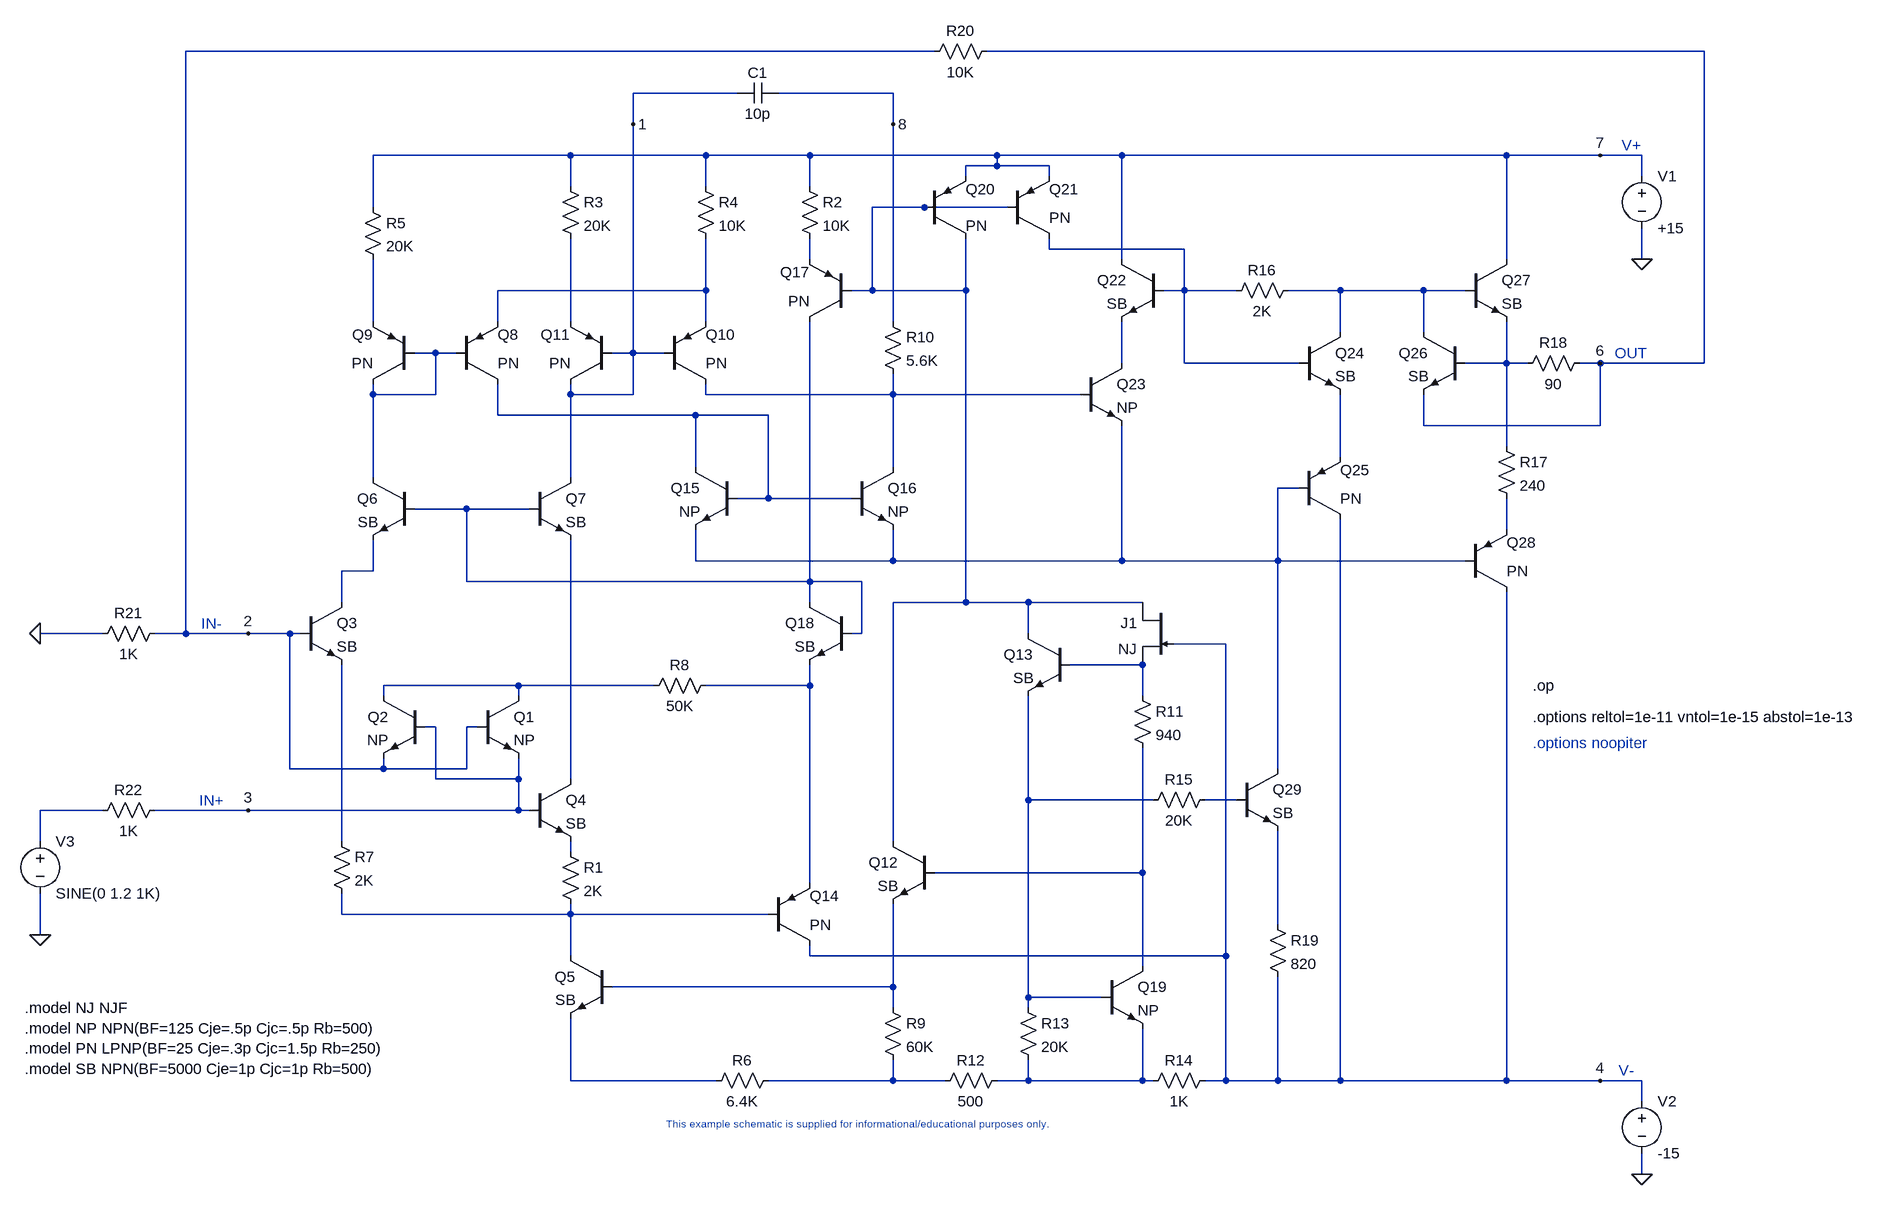
[diagram p0: schematic debugDotOp.asc]
debugDotOp.asc, the LTspice schematic file:
Version 4
SHEET 1 4272 2276
WIRE 2448 528 1296 528
WIRE 3632 528 2528 528
WIRE 2144 592 1984 592
WIRE 2384 592 2208 592
WIRE 1984 640 1984 592
WIRE 2384 640 2384 592
WIRE 1888 688 1584 688
WIRE 2096 688 1888 688
WIRE 2256 688 2096 688
WIRE 2544 688 2256 688
WIRE 2736 688 2544 688
WIRE 3328 688 2736 688
WIRE 3472 688 3328 688
WIRE 3536 688 3472 688
WIRE 2544 704 2544 688
WIRE 2544 704 2496 704
WIRE 2624 704 2544 704
WIRE 2496 720 2496 704
WIRE 2624 720 2624 704
WIRE 3536 720 3536 688
WIRE 1888 736 1888 688
WIRE 2096 736 2096 688
WIRE 2256 736 2256 688
WIRE 1584 768 1584 688
WIRE 2432 768 2352 768
WIRE 2560 768 2432 768
WIRE 2624 832 2624 816
WIRE 2832 832 2624 832
WIRE 2256 848 2256 816
WIRE 2736 848 2736 688
WIRE 3328 848 3328 688
WIRE 3536 848 3536 800
WIRE 2096 896 2096 816
WIRE 2096 896 1776 896
WIRE 2352 896 2352 768
WIRE 2352 896 2320 896
WIRE 2496 896 2496 816
WIRE 2496 896 2352 896
WIRE 2832 896 2832 832
WIRE 2832 896 2800 896
WIRE 2912 896 2832 896
WIRE 3072 896 2992 896
WIRE 3200 896 3072 896
WIRE 3264 896 3200 896
WIRE 1584 944 1584 848
WIRE 1776 944 1776 896
WIRE 1888 944 1888 816
WIRE 2096 944 2096 896
WIRE 2384 944 2384 640
WIRE 3072 960 3072 896
WIRE 3200 960 3200 896
WIRE 1680 992 1648 992
WIRE 1712 992 1680 992
WIRE 1984 992 1984 640
WIRE 1984 992 1952 992
WIRE 2032 992 1984 992
WIRE 2736 1008 2736 944
WIRE 2832 1008 2832 896
WIRE 3008 1008 2832 1008
WIRE 3328 1008 3328 944
WIRE 3328 1008 3264 1008
WIRE 3360 1008 3328 1008
WIRE 3472 1008 3440 1008
WIRE 3632 1008 3632 528
WIRE 3632 1008 3472 1008
WIRE 1584 1056 1584 1040
WIRE 1680 1056 1680 992
WIRE 1680 1056 1584 1056
WIRE 1888 1056 1888 1040
WIRE 1984 1056 1984 992
WIRE 1984 1056 1888 1056
WIRE 2096 1056 2096 1040
WIRE 2384 1056 2384 1024
WIRE 2384 1056 2096 1056
WIRE 2672 1056 2384 1056
WIRE 1776 1088 1776 1040
WIRE 2080 1088 1776 1088
WIRE 2192 1088 2080 1088
WIRE 3200 1104 3200 1056
WIRE 3472 1104 3472 1008
WIRE 3472 1104 3200 1104
WIRE 3328 1136 3328 1008
WIRE 3072 1152 3072 1056
WIRE 2080 1168 2080 1088
WIRE 2384 1168 2384 1056
WIRE 1584 1184 1584 1056
WIRE 1888 1184 1888 1056
WIRE 3008 1200 2976 1200
WIRE 2192 1216 2192 1088
WIRE 2192 1216 2144 1216
WIRE 2320 1216 2192 1216
WIRE 1728 1232 1648 1232
WIRE 1824 1232 1728 1232
WIRE 3328 1264 3328 1216
WIRE 2080 1312 2080 1264
WIRE 2384 1312 2384 1264
WIRE 2384 1312 2080 1312
WIRE 2736 1312 2736 1104
WIRE 2736 1312 2384 1312
WIRE 2976 1312 2976 1200
WIRE 2976 1312 2736 1312
WIRE 3264 1312 2976 1312
WIRE 1584 1328 1584 1280
WIRE 1584 1328 1536 1328
WIRE 1728 1344 1728 1232
WIRE 2256 1344 2256 944
WIRE 2256 1344 1728 1344
WIRE 2336 1344 2256 1344
WIRE 1536 1376 1536 1328
WIRE 2256 1376 2256 1344
WIRE 2496 1376 2496 896
WIRE 2496 1376 2384 1376
WIRE 2592 1376 2496 1376
WIRE 2768 1376 2592 1376
WIRE 1168 1424 1072 1424
WIRE 1296 1424 1296 528
WIRE 1296 1424 1248 1424
WIRE 1392 1424 1296 1424
WIRE 1456 1424 1392 1424
WIRE 1472 1424 1456 1424
WIRE 2336 1424 2336 1344
WIRE 2336 1424 2320 1424
WIRE 2592 1424 2592 1376
WIRE 2896 1440 2816 1440
WIRE 2768 1472 2656 1472
WIRE 1808 1504 1600 1504
WIRE 2016 1504 1808 1504
WIRE 2256 1504 2256 1472
WIRE 2256 1504 2096 1504
WIRE 1600 1520 1600 1504
WIRE 1808 1520 1808 1504
WIRE 2768 1520 2768 1472
WIRE 1680 1568 1664 1568
WIRE 1744 1568 1728 1568
WIRE 1456 1632 1456 1424
WIRE 1600 1632 1600 1616
WIRE 1600 1632 1456 1632
WIRE 1728 1632 1728 1568
WIRE 1728 1632 1600 1632
WIRE 2976 1632 2976 1312
WIRE 1680 1648 1680 1568
WIRE 1808 1648 1808 1616
WIRE 1808 1648 1680 1648
WIRE 1888 1648 1888 1280
WIRE 2592 1680 2592 1520
WIRE 2784 1680 2592 1680
WIRE 2912 1680 2864 1680
WIRE 1168 1696 1072 1696
WIRE 1392 1696 1248 1696
WIRE 1808 1696 1808 1648
WIRE 1808 1696 1392 1696
WIRE 1824 1696 1808 1696
WIRE 1072 1744 1072 1696
WIRE 1536 1744 1536 1472
WIRE 2384 1744 2384 1376
WIRE 1888 1760 1888 1744
WIRE 2768 1792 2768 1600
WIRE 2768 1792 2448 1792
WIRE 2256 1808 2256 1504
WIRE 1536 1856 1536 1824
WIRE 1888 1856 1888 1840
WIRE 1888 1856 1536 1856
WIRE 2192 1856 1888 1856
WIRE 2976 1872 2976 1728
WIRE 1072 1888 1072 1824
WIRE 1888 1920 1888 1856
WIRE 2256 1920 2256 1904
WIRE 2896 1920 2896 1440
WIRE 2896 1920 2256 1920
WIRE 2768 1936 2768 1792
WIRE 2384 1968 2384 1840
WIRE 2384 1968 1952 1968
WIRE 2592 1984 2592 1680
WIRE 2704 1984 2592 1984
WIRE 2384 2000 2384 1968
WIRE 2592 2000 2592 1984
WIRE 1888 2112 1888 2016
WIRE 2112 2112 1888 2112
WIRE 2384 2112 2384 2080
WIRE 2384 2112 2192 2112
WIRE 2464 2112 2384 2112
WIRE 2592 2112 2592 2080
WIRE 2592 2112 2544 2112
WIRE 2768 2112 2768 2032
WIRE 2768 2112 2592 2112
WIRE 2784 2112 2768 2112
WIRE 2896 2112 2896 1920
WIRE 2896 2112 2864 2112
WIRE 2976 2112 2976 1952
WIRE 2976 2112 2896 2112
WIRE 3072 2112 3072 1248
WIRE 3072 2112 2976 2112
WIRE 3328 2112 3328 1360
WIRE 3328 2112 3072 2112
WIRE 3472 2112 3328 2112
WIRE 3536 2112 3472 2112
WIRE 3536 2144 3536 2112
WIRE 3536 2256 3536 2224
FLAG 1392 1424 2
FLAG 1392 1696 3
FLAG 1984 640 1
FLAG 2384 640 8
FLAG 3472 1008 6
FLAG 3472 688 7
FLAG 3472 2112 4
FLAG 3536 848 0
FLAG 3536 2256 0
FLAG 1072 1888 0
FLAG 1072 1424 0
SYMBOL npn 1744 1520 R0
SYMATTR InstName Q1
SYMATTR Value NP
SYMBOL npn 1664 1520 M0
SYMATTR InstName Q2
SYMATTR Value NP
SYMBOL NPN3 1472 1376 R0
SYMATTR InstName Q3
SYMATTR Value SB
SYMBOL npn3 1824 1648 R0
SYMATTR InstName Q4
SYMATTR Value SB
SYMBOL npn3 1952 1920 M0
SYMATTR InstName Q5
SYMATTR Value SB
SYMBOL npn3 1648 1184 M0
SYMATTR InstName Q6
SYMATTR Value SB
SYMBOL npn3 1824 1184 R0
SYMATTR InstName Q7
SYMATTR Value SB
SYMBOL res 1872 1744 R0
SYMATTR InstName R1
SYMATTR Value 2K
SYMBOL res 1872 720 R0
SYMATTR InstName R3
SYMATTR Value 20K
SYMBOL pnp 1712 1040 M180
WINDOW 0 64 76 Left 2
WINDOW 3 64 32 Left 2
SYMATTR InstName Q8
SYMATTR Value PN
SYMBOL pnp 1648 1040 R180
WINDOW 0 64 76 Left 2
WINDOW 3 64 32 Left 2
SYMATTR InstName Q9
SYMATTR Value PN
SYMBOL res 2080 720 R0
SYMATTR InstName R4
SYMATTR Value 10K
SYMBOL res 1568 752 R0
SYMATTR InstName R5
SYMATTR Value 20K
SYMBOL pnp 2032 1040 M180
WINDOW 0 64 76 Left 2
WINDOW 3 64 32 Left 2
SYMATTR InstName Q10
SYMATTR Value PN
SYMBOL pnp 1952 1040 R180
WINDOW 0 64 76 Left 2
WINDOW 3 64 32 Left 2
SYMATTR InstName Q11
SYMATTR Value PN
SYMBOL res 2096 2128 R270
WINDOW 0 32 56 VTop 2
WINDOW 3 0 56 VBottom 2
SYMATTR InstName R6
SYMATTR Value 6.4K
SYMBOL res 1520 1728 R0
SYMATTR InstName R7
SYMATTR Value 2K
SYMBOL res 2000 1520 R270
WINDOW 0 32 56 VTop 2
WINDOW 3 0 56 VBottom 2
SYMATTR InstName R8
SYMATTR Value 50K
SYMBOL res 2368 1984 R0
SYMATTR InstName R9
SYMATTR Value 60K
SYMBOL npn3 2448 1744 M0
SYMATTR InstName Q12
SYMATTR Value SB
SYMBOL pnp 2192 1904 M180
WINDOW 0 64 76 Left 2
WINDOW 3 64 32 Left 2
SYMATTR InstName Q14
SYMATTR Value PN
SYMBOL npn 2144 1168 M0
SYMATTR InstName Q15
SYMATTR Value NP
SYMBOL npn 2320 1168 R0
SYMATTR InstName Q16
SYMATTR Value NP
SYMBOL res 2240 720 R0
SYMATTR InstName R2
SYMATTR Value 10K
SYMBOL pnp 2320 944 R180
WINDOW 0 64 76 Left 2
WINDOW 3 64 32 Left 2
SYMATTR InstName Q17
SYMATTR Value PN
SYMBOL npn3 2320 1376 M0
SYMATTR InstName Q18
SYMATTR Value SB
SYMBOL res 2368 928 R0
SYMATTR InstName R10
SYMATTR Value 5.6K
SYMBOL cap 2208 576 R90
WINDOW 0 0 32 VBottom 2
WINDOW 3 32 32 VTop 2
SYMATTR InstName C1
SYMATTR Value 10p
SYMBOL npn3 2656 1424 M0
SYMATTR InstName Q13
SYMATTR Value SB
SYMBOL res 2752 1504 R0
SYMATTR InstName R11
SYMATTR Value 940
SYMBOL res 2448 2128 R270
WINDOW 0 32 56 VTop 2
WINDOW 3 0 56 VBottom 2
SYMATTR InstName R12
SYMATTR Value 500
SYMBOL res 2576 1984 R0
SYMATTR InstName R13
SYMATTR Value 20K
SYMBOL npn 2704 1936 R0
SYMATTR InstName Q19
SYMATTR Value NP
SYMBOL NJF 2816 1376 M0
SYMATTR InstName J1
SYMATTR Value NJ
SYMBOL res 2768 2128 R270
WINDOW 0 32 56 VTop 2
WINDOW 3 0 56 VBottom 2
SYMATTR InstName R14
SYMATTR Value 1K
SYMBOL res 2880 1664 R90
WINDOW 0 0 56 VBottom 2
WINDOW 3 32 56 VTop 2
SYMATTR InstName R15
SYMATTR Value 20K
SYMBOL pnp 2432 816 M180
WINDOW 0 64 76 Left 2
WINDOW 3 64 20 Left 2
SYMATTR InstName Q20
SYMATTR Value PN
SYMBOL pnp 2560 816 M180
WINDOW 0 64 76 Left 2
WINDOW 3 64 32 Left 2
SYMATTR InstName Q21
SYMATTR Value PN
SYMBOL npn3 2800 848 M0
SYMATTR InstName Q22
SYMATTR Value SB
SYMBOL npn 2672 1008 R0
SYMATTR InstName Q23
SYMATTR Value NP
SYMBOL res 2896 912 R270
WINDOW 0 32 56 VTop 2
WINDOW 3 0 56 VBottom 2
SYMATTR InstName R16
SYMATTR Value 2K
SYMBOL npn3 3008 960 R0
SYMATTR InstName Q24
SYMATTR Value SB
SYMBOL pnp 3008 1248 M180
WINDOW 0 64 76 Left 2
WINDOW 3 64 32 Left 2
SYMATTR InstName Q25
SYMATTR Value PN
SYMBOL npn3 3264 960 M0
SYMATTR InstName Q26
SYMATTR Value SB
SYMBOL npn3 3264 848 R0
SYMATTR InstName Q27
SYMATTR Value SB
SYMBOL pnp 3264 1360 M180
WINDOW 0 64 76 Left 2
WINDOW 3 64 32 Left 2
SYMATTR InstName Q28
SYMATTR Value PN
SYMBOL res 3312 1120 R0
SYMATTR InstName R17
SYMATTR Value 240
SYMBOL res 3344 1024 R270
WINDOW 0 32 56 VTop 2
WINDOW 3 0 56 VBottom 2
SYMATTR InstName R18
SYMATTR Value 90
SYMBOL npn3 2912 1632 R0
SYMATTR InstName Q29
SYMATTR Value SB
SYMBOL voltage 3536 704 R0
SYMATTR InstName V1
SYMATTR Value +15
SYMBOL voltage 3536 2128 R0
SYMATTR InstName V2
SYMATTR Value -15
SYMBOL res 2960 1856 R0
SYMATTR InstName R19
SYMATTR Value 820
SYMBOL res 2544 512 R90
WINDOW 0 0 56 VBottom 2
WINDOW 3 32 56 VTop 2
SYMATTR InstName R20
SYMATTR Value 10K
SYMBOL res 1264 1408 R90
WINDOW 0 0 56 VBottom 2
WINDOW 3 32 56 VTop 2
SYMATTR InstName R21
SYMATTR Value 1K
SYMBOL res 1264 1680 R90
WINDOW 0 0 56 VBottom 2
WINDOW 3 32 56 VTop 2
SYMATTR InstName R22
SYMATTR Value 1K
SYMBOL voltage 1072 1728 R0
SYMATTR InstName V3
SYMATTR Value SINE(0 1.2 1K)
TEXT 1336 1424 Bottom 2 ;IN-
TEXT 1336 1696 Bottom 2 ;IN+
TEXT 3368 1504 Left 2 !.op
TEXT 1048 2000 Left 2 !.model NJ NJF\n.model NP NPN(BF=125 Cje=.5p Cjc=.5p Rb=500)\n.model PN LPNP(BF=25 Cje=.3p Cjc=1.5p Rb=250)\n.model SB NPN(BF=5000 Cje=1p Cjc=1p Rb=500)
TEXT 2320 2168 Top 1 ;This example schematic is supplied for informational/educational purposes only.
TEXT 3520 1008 Bottom 2 ;OUT
TEXT 3520 688 Bottom 2 ;V+
TEXT 3512 2112 Bottom 2 ;V-
TEXT 3368 1592 Left 2 ;.options noopiter
TEXT 3368 1552 Left 2 !.options reltol=1e-11 vntol=1e-15 abstol=1e-13

The netlist it stands for:
* debugDotOp.asc
Q1 N019 2 3 0 NP
Q2 N019 3 2 0 NP
Q3 N017 2 N025 0 SB
Q4 N021 3 N026 0 SB
Q5 N028 N030 N031 0 SB
Q6 N008 N015 N017 0 SB
Q7 1 N015 N021 0 SB
R1 N026 N028 2K
R3 7 N007 20K
Q8 N012 N008 N004 0 PN
Q9 N008 N008 N006 0 PN
R4 7 N004 10K
R5 7 N006 20K
Q10 N011 1 N004 0 PN
Q11 1 1 N007 0 PN
R6 N031 N032 6.4K
R7 N025 N028 2K
R8 N019 N020 50K
R9 N030 N032 60K
Q12 N001 N027 N030 0 SB
Q14 4 N028 N020 0 PN
Q15 N012 N012 N014 0 NP
Q16 N011 N012 N014 0 NP
R2 7 N003 10K
Q17 N015 N001 N003 0 PN
Q18 N015 N015 N020 0 SB
R10 8 N011 5.6K
C1 8 1 10p
Q13 N001 N018 N022 0 SB
R11 N018 N027 940
R12 N032 N033 500
R13 N022 N033 20K
Q19 N027 N022 N033 0 NP
J1 N001 4 N018 NJ
R14 N033 4 1K
R15 N023 N022 20K
Q20 N001 N001 7 0 PN
Q21 N002 N001 7 0 PN
Q22 7 N002 N009 0 SB
Q23 N009 N011 N014 0 NP
R16 N002 N005 2K
Q24 N005 N002 N013 0 SB
Q25 4 N014 N013 0 PN
Q26 N005 N010 6 0 SB
Q27 7 N005 N010 0 SB
Q28 4 N014 N016 0 PN
R17 N010 N016 240
R18 N010 6 90
Q29 N014 N023 N029 0 SB
V1 7 0 +15
V2 4 0 -15
R19 N029 4 820
R20 6 2 10K
R21 2 0 1K
R22 3 N024 1K
V3 N024 0 SINE(0 1.2 1K)
.model NPN NPN
.model PNP PNP
.lib standard.bjt
.model NJF NJF
.model PJF PJF
.lib standard.jft
* IN-
* IN+
.op
.model NJ NJF
.model NP NPN(BF=125 Cje=.5p Cjc=.5p Rb=500)
.model PN LPNP(BF=25 Cje=.3p Cjc=1.5p Rb=250)
.model SB NPN(BF=5000 Cje=1p Cjc=1p Rb=500)
* This example schematic is supplied for informational/educational purposes only.
* OUT
* V+
* V-
* .options noopiter
.options reltol=1e-11 vntol=1e-15 abstol=1e-13
.backanno
.end